# EAGLE design SIPM_readout (EAGLE 9.6.2)
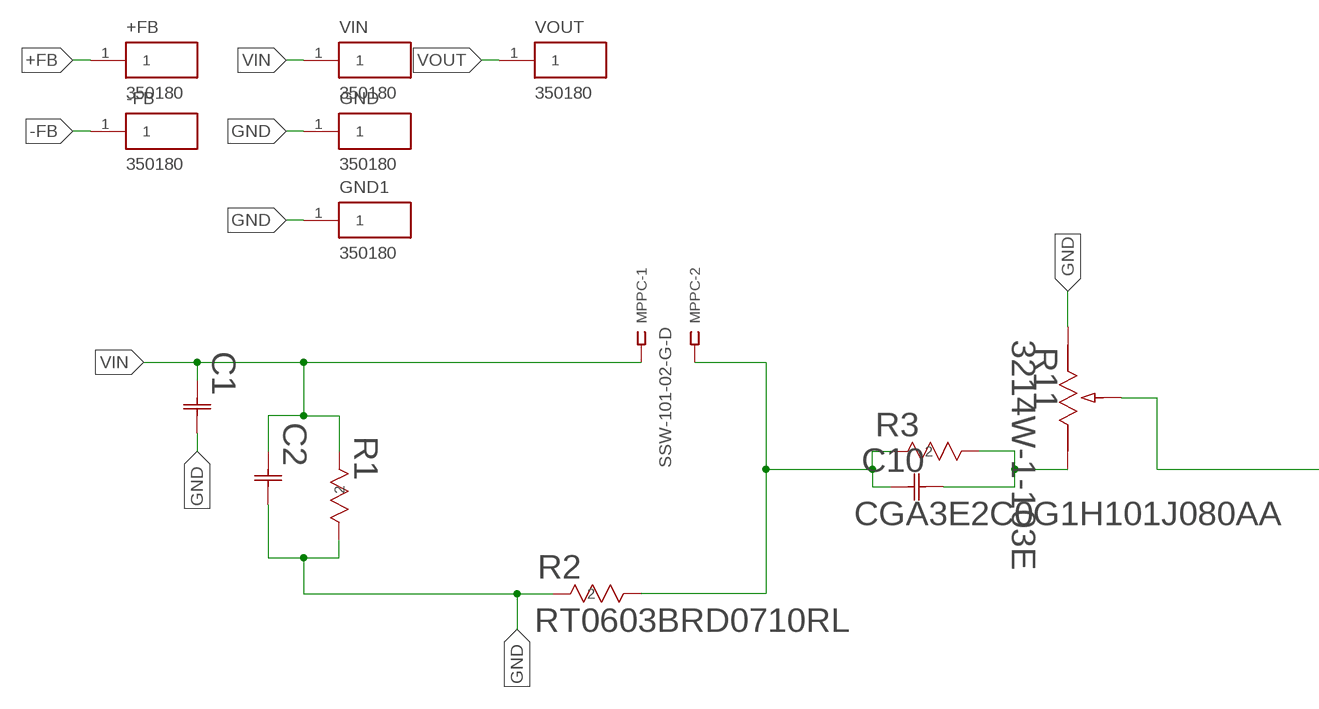
[diagram p0: schematic, sheet 1, part 1 of 2]
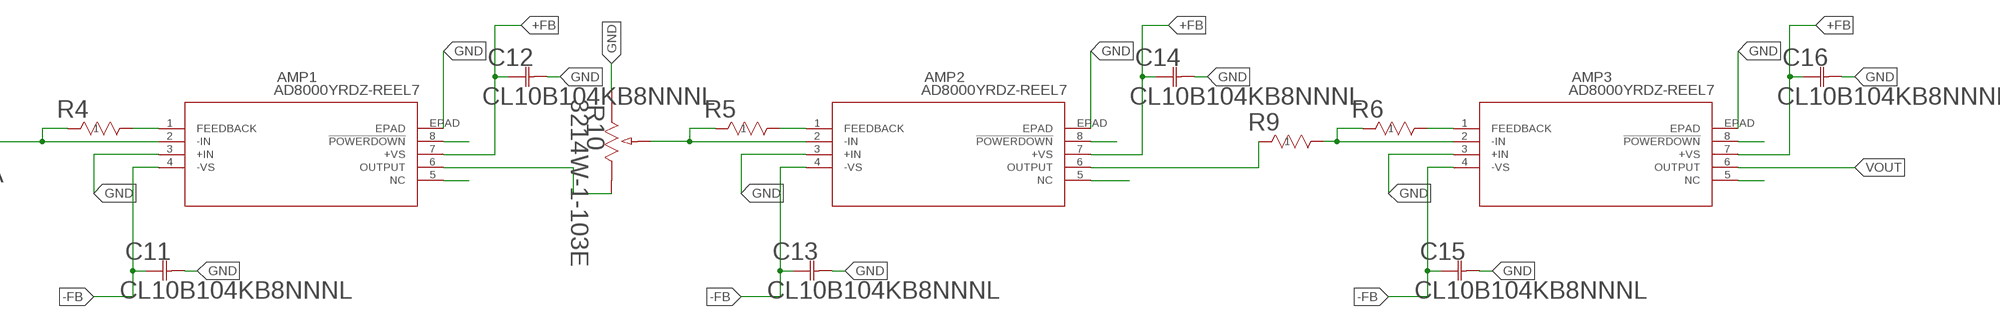
[diagram p1: schematic, sheet 1, part 2 of 2]

## Parts
+FB  350180  [TE_350180]
-FB  350180  [TE_350180]
AMP1  AD8000YRDZ-REEL7  [RD_8_1_ADI]
AMP2  AD8000YRDZ-REEL7  [RD_8_1_ADI]
AMP3  AD8000YRDZ-REEL7  [RD_8_1_ADI]
C1  CGA6P3X7R1H335K250AB  [CAP_3225_TDK]
C2  C3225X7R1H105K160AA  [CAP_3225_TDK]
C10  CGA3E2C0G1H101J080AA  [CAP_1608_TDK]
C11  CL10B104KB8NNNL  [CAP_CL10_SAM]
C12  CL10B104KB8NNNL  [CAP_CL10_SAM]
C13  CL10B104KB8NNNL  [CAP_CL10_SAM]
C14  CL10B104KB8NNNL  [CAP_CL10_SAM]
C15  CL10B104KB8NNNL  [CAP_CL10_SAM]
C16  CL10B104KB8NNNL  [CAP_CL10_SAM]
GND  350180  [TE_350180]
GND1  350180  [TE_350180]
MPPC  SSW-101-02-G-D  [SSW-101-02-G-D]
R1  RC0603FR-072ML  [RC0603N_YAG]
R2  RT0603BRD0710RL  [RC0603N_YAG]
R3  RT0603BRD0710RL  [RC0603N_YAG]
R4  ESR03EZPF1001  [RES_R0603_ROM]
R5  ESR03EZPF1001  [RES_R0603_ROM]
R6  ESR03EZPF1001  [RES_R0603_ROM]
R9  ESR03EZPF1001  [RES_R0603_ROM]
R10  3214W-1-103E  [POT_3214W]
R11  3214W-1-103E  [POT_3214W]
VIN  350180  [TE_350180]
VOUT  350180  [TE_350180]

## Nets
+FB: +FB.1 AMP1.7(+VS) AMP2.7(+VS) AMP3.7(+VS) C12.1 C14.1 C16.1
-FB: -FB.1 AMP1.4(-VS) AMP2.4(-VS) AMP3.4(-VS) C11.1 C13.1 C15.1
GND: AMP1.3(+IN) AMP1.EPAD AMP2.3(+IN) AMP2.EPAD AMP3.3(+IN) AMP3.EPAD C1.2 C2.2 C11.2 C12.2 C13.2 C14.2 C15.2 C16.2 GND1.1 GND.1 R1.1 R2.2 R10.1 R11.1
N$1: AMP1.6(OUTPUT) R10.3
N$2: C10.1 MPPC.2 R2.1 R3.2
N$3: C10.2 R3.1 R11.3
N$4: AMP1.2(-IN) R4.1 R11.2
N$5: AMP1.5(NC)
N$6: AMP1.8(!POWERDOWN)
N$7: AMP1.1(FEEDBACK) R4.2
N$9: AMP2.8(!POWERDOWN)
N$10: AMP2.5(NC)
N$11: AMP2.1(FEEDBACK) R5.2
N$12: AMP2.2(-IN) R5.1 R10.2
N$14: AMP3.8(!POWERDOWN)
N$15: AMP3.5(NC)
N$16: AMP3.1(FEEDBACK) R6.2
N$17: AMP3.2(-IN) R6.1 R9.2
N$18: AMP2.6(OUTPUT) R9.1
VIN: C1.1 C2.1 MPPC.1 R1.2 VIN.1
VOUT: AMP3.6(OUTPUT) VOUT.1

## Library data of the parts
+FB -FB GND GND1 VIN VOUT = SiPM_banana:350180: Connector TeStraight Probe RCP 3 Position Solder Right Angle Thru-Hole 1 Port Check prices <https://pricing.snapeda.com/parts/350180/TE%20Connectivity/view-part?ref=eda>; AVAILABILITY: Good; COMMENT: 350180; DESCRIPTION: Connector TeStraight Probe RCP 3 Position Solder Right Angle Thru-Hole 1 Port; MF: TE Connectivity; MP: 350180; PACKAGE: None; PRICE: None; PURCHASE-URL: https://pricing.snapeda.com/search/part/350180/?ref=eda
AMP1-AMP3 = SiPM_AD8000:AD8000YRDZ-REEL7; BUILT_BY: EMA_Jessica; COPYRIGHT: Copyright (C) 2018 Accelerated Designs. All rights reserved; MANUFACTURER_PART_NUMBER: AD8000YRDZ-REEL7; SOURCELIBRARY: Analog_2019-03-01; VENDOR: Analog Devices Inc
C1 = SiPM_C3:CGA6P3X7R1H335K250AB; BUILT_BY: EMA_UL_Team; MANUFACTURER_PART_NUMBER: CGA6P3X7R1H335K250AB; SOURCELIBRARY: TDK_2015_05_22; VENDOR: TDK
C2 = SiPM_C4:C3225X7R1H105K160AA; BUILT_BY: EMA_UL_Team; MANUFACTURER_PART_NUMBER: C3225X7R1H105K160AA; SOURCELIBRARY: TDK_2015_05_22; VENDOR: TDK
C10 = SiPM_100p:CGA3E2C0G1H101J080AA; BUILT_BY: EMA_UL_Team; MANUFACTURER_PART_NUMBER: CGA3E2C0G1H101J080AA; SOURCELIBRARY: TDK_2015_05_22; VENDOR: TDK
C11-C16 = SiPM_01u:CL10B104KB8NNNL; BUILT_BY: EMA_Rocco; COPYRIGHT: Copyright (C) 2018 Accelerated Designs. All rights reserved; MANUFACTURER_PART_NUMBER: CL10B104KB8NNNL; SOURCELIBRARY: Samsung_2019-08-29; VENDOR: Samsung
MPPC = con-samtec:SSW-101-02-G: THROUGH-HOLE .025" SQ POST SOCKET Source: Samtec SSW.pdf; MF: Samtec Inc.; MPN: SSW-101-02-G-D; OC_FARNELL: unknown; OC_NEWARK: 82P1456
R1 = SiPM_R6:RC0603FR-072ML; BUILT_BY: EMA_UL_Team; MANUFACTURER_PART_NUMBER: RC0603FR-072ML; SOURCELIBRARY: Yageo_2008-01-01_ChipRes1a; VENDOR: Yageo
R2 R3 = SiPM_R7:RT0603BRD0710RL; BUILT_BY: EMA_UL_Team; MANUFACTURER_PART_NUMBER: RT0603BRD0710RL; SOURCELIBRARY: Yageo_2008-01-01_ChipRes2b; VENDOR: Yageo
R4-R6 R9 = SiPM_R11:ESR03EZPF1001; BUILT_BY: EMA_UL_Team; MANUFACTURER_PART_NUMBER: ESR03EZPF1001; SOURCELIBRARY: Rohm_2015_05_27; VENDOR: ROHM Semiconductor
R10 R11 = SiPM_trim:3214W-1-103E; BUILT_BY: EMA_UL_Team; MANUFACTURER_PART_NUMBER: 3214W-1-103E; SOURCELIBRARY: Bourns_2012-08-08; VENDOR: Bourns Electronics

## Board
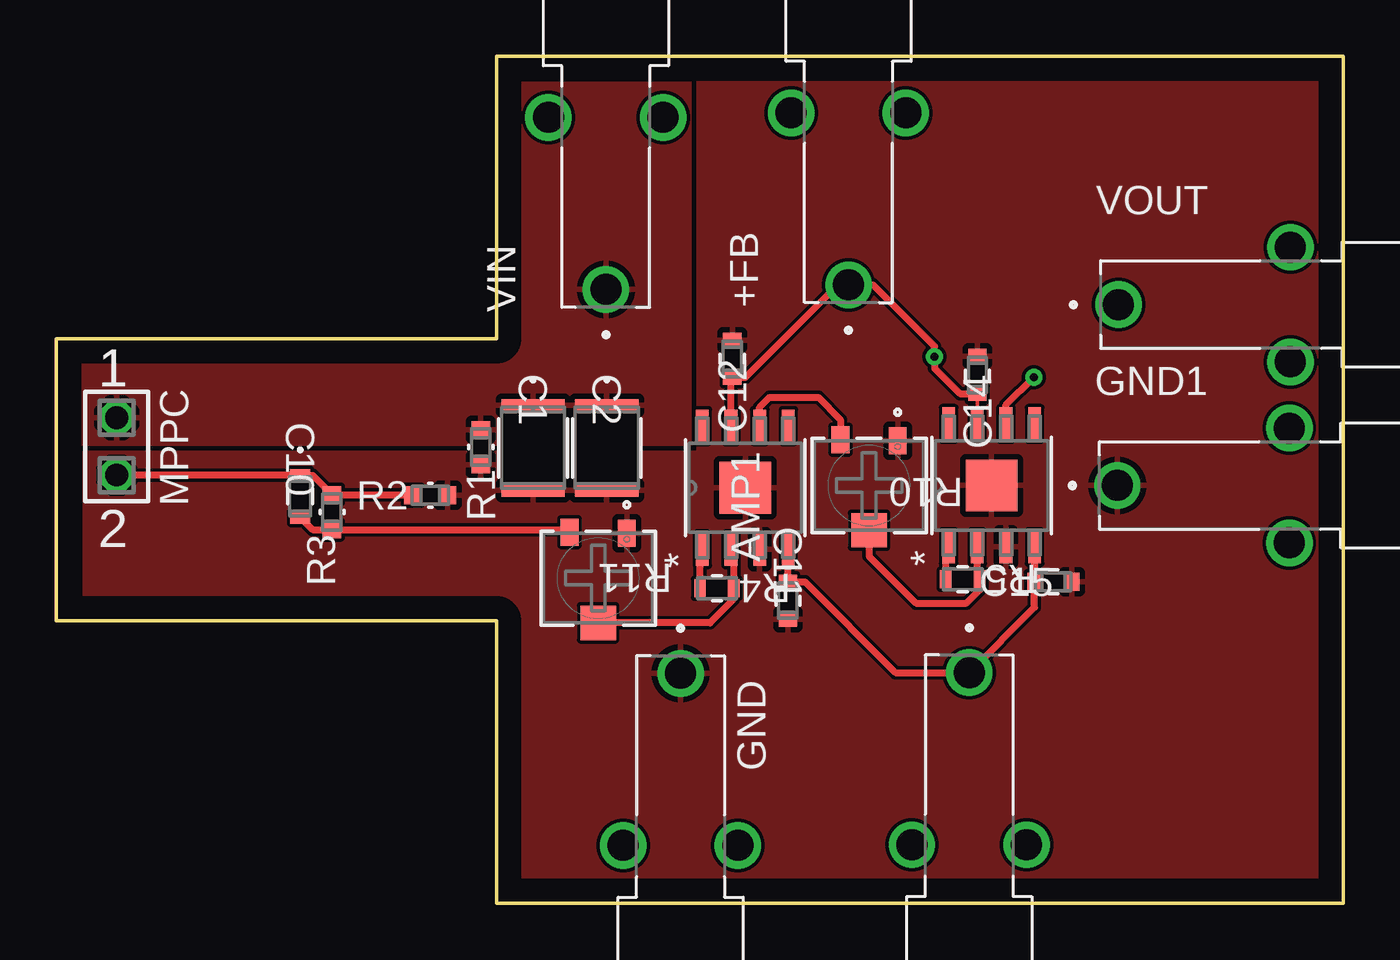
[diagram p2: board, top side]
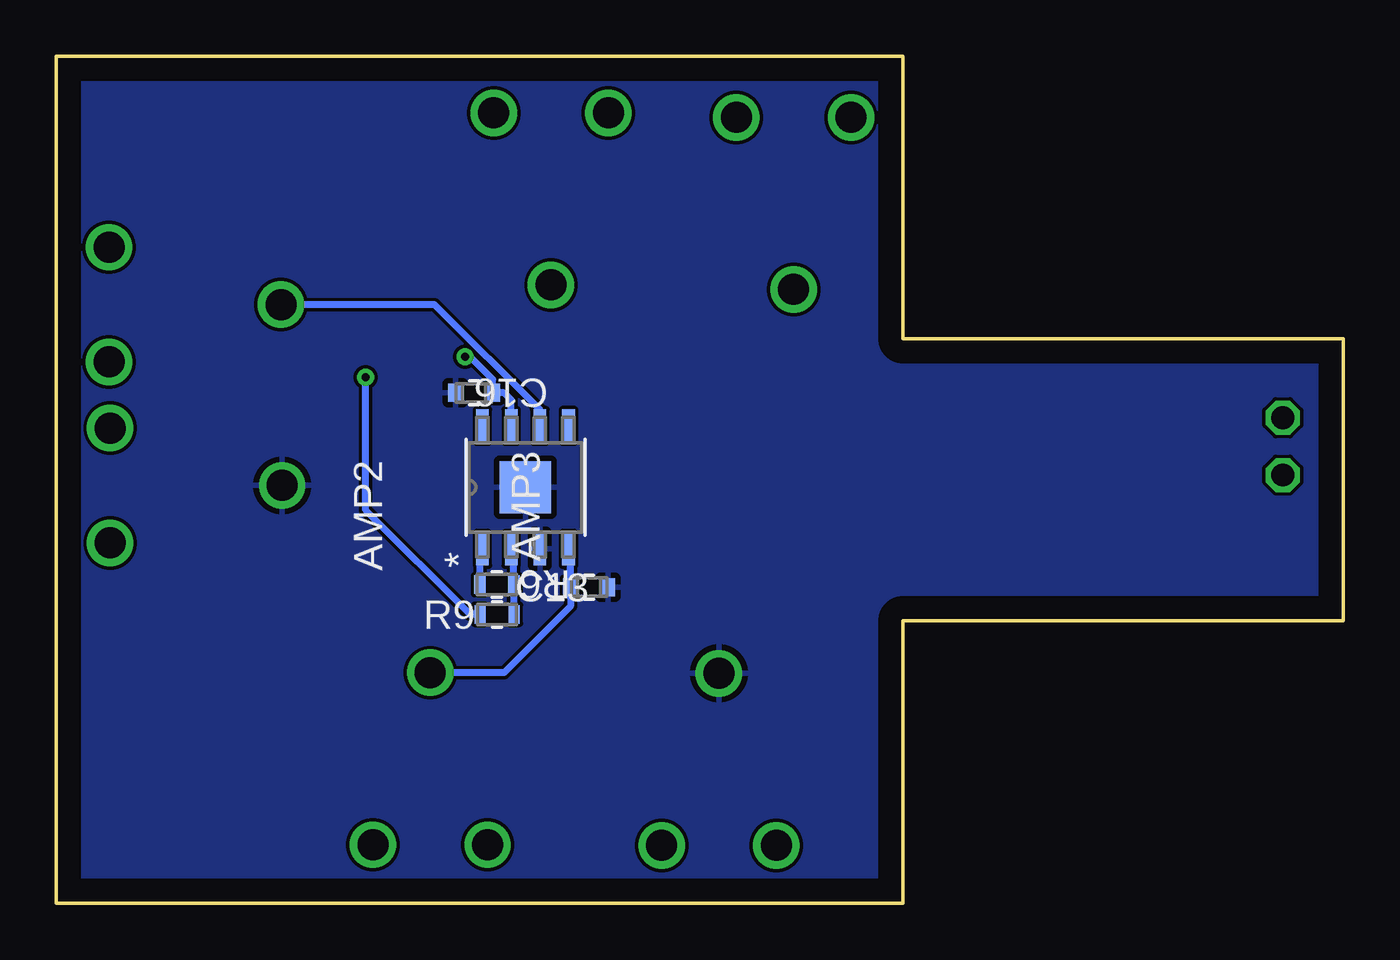
[diagram p3: board, bottom side, seen from below]

Size 57 x 37.5 mm. Coordinates in mm from the lower left corner, seen from the top.
Outline: 57,0 19.5,0 19.5,12.5 0,12.5 0,25 19.5,25 19.5,37.5 57,37.5 57,0
Copper layers (1*16): Top 0.035mm / dielectric 1.5mm / Bottom 0.035mm
Design rules "default": minimum track width 6mil, minimum drill 0.35mm, track to track 6mil, track to pad 6mil, pad to pad 6mil, via to via 6mil, smd to smd 6mil, copper to edge 40mil, drill to drill 6mil, minimum pad ring 10mil, minimum via ring 8mil, stop-mask expansion 4mil, vias tented up to drill 0mil, thermal gap 10mil

### Footprints (pad centres in the part's own frame; a part is rotated, then mirrored left to right if it is on the bottom)
TE_350180 = drill 1.372: 1 0,0; S1 7.62,2.54; S2 7.62,-2.54
RD_8_1_ADI = smd 1.46 x 0.559: 1 -2.724,1.905; 2 -2.724,0.635; 3 -2.724,-0.635; 4 -2.724,-1.905; 5 2.724,-1.905; 6 2.724,-0.635; 7 2.724,0.635; 8 2.724,1.905 | smd 2.286 x 2.286: EPAD 0,0
CAP_3225_TDK = smd 0.559 x 2.794: 1 -1.88,0; 2 1.88,0
CAP_1608_TDK = smd 0.559 x 0.889: 1 -0.927,0; 2 0.927,0
CAP_CL10_SAM = smd 0.656 x 0.8: 1 -0.828,0; 2 0.828,0
SSW-101-02-G-D = drill 1 pad 1.5 octagon: 1 0,-1.27; 2 0,1.27
RC0603N_YAG = smd 0.762 x 0.813: 1 -0.775,0; 2 0.775,0
RES_R0603_ROM = smd 0.5 x 0.813: 1 -0.75,0; 2 0.75,0
POT_3214W = smd 0.787 x 1.194: 1 -1.27,-1.981; 3 1.27,-2.032 | smd 1.575 x 1.524: 2 0,1.981

### Placement (x,y rotation side)
+FB  35.09,27.38 90 top
-FB  40.44,10.21 270 top
AMP1  30.52,18.4 90 top
AMP2  41.43,18.5 90 top
AMP3  36.22,18.42 90 bottom
C1  21.11,20.17 270 top
C2  24.38,20.17 270 top
C10  10.8,18.02 270 top
C11  32.4,13.4 270 top
C12  29.94,24.11 90 top
C13  33.4,14 0 bottom
C14  40.8,23.4 90 top
C15  44.16,14.24 0 top
C16  38.5,22.6 180 bottom
GND  27.65,10.18 270 top
GND1  47,18.5 0 top
MPPC  2.67,20.23 180 top
R1  18.8,20.2 90 top
R2  16.56,18.07 0 top
R3  12.21,17.32 90 top
R4  29.26,13.95 180 top
R5  40.15,14.35 180 top
R6  37.49,14.11 180 bottom
R9  37.48,12.79 0 bottom
R10  36,18.5 180 top
R11  24,14.4 180 top
VIN  24.34,27.18 90 top
VOUT  47.05,26.51 0 top

### Tracks (layer width: path | path; a pad name or v marks a point on that pad's centre or on a via)
+FB  (via drill 0.35)
  Top 0.152: AMP1.7 29.9,21.14 | AMP2.7 C14.1
  Top 0.3: C14.1 40.03,22.57 38.9,23.7 v38.9,24.2 38.9,24.66 36.18,27.38 +FB.1 34.62,27.38 30.52,23.28 C12.1 29.88,23.23 AMP1.7
  Top 0.5: AMP1.7 29.87,21.14
  Bottom 0.3: AMP3.7 36.85,22.3 37.16,22.6 C16.1 37.67,23.2 38.67,24.2 v38.9,24.2
-FB
  Top 0.152: 43.33,13.88 C15.1
  Top 0.3: AMP1.4 32.4,15.65 C11.1 33.15,14.23 37.17,10.21 -FB.1 43.34,13.11 C15.1 | AMP2.4 C15.1 | C15.1
  Bottom 0.152: 34.31,14.09 C13.1
  Bottom 0.3: -FB.1 37.17,10.21 34.23,13.15 C13.1 34.23,15.61 AMP3.4
GND
  Bottom 0.152: 35.92,15.7 AMP3.3
  pour Top: 19.7,0.2 19.7,12.7 1.2,12.7 1.2,20 28.4,20 28.4,37.2 56.8,37.2 56.8,0.1 19.8,0.1
  pour Bottom: 0,12.5 19.5,12.5 19.5,0 57,0 57,37.5 19.5,37.5 19.5,25 0,25
N$1
  Top 0.3: AMP1.6 31.16,21.96 31.59,22.4 33.76,22.4 34.73,21.42 R10.3
N$2
  Top 0.152: 15.75,18.3 15.82,18.22
  Top 0.3: 16.05,18 15.82,18.22 15.82,18.11 R2.1 15.76,18.09 R3.2 11.36,18.95 C10.1 10.79,18.96 MPPC.2
N$3
  Top 0.152: 12.14,16.47 R3.1
  Top 0.3: C10.2 11.35,16.55 R3.1 22.62,16.55 R11.3
  Top 0.5: R3.1 12.17,16.51
N$4
  Top 0.3: R11.2 28.95,12.41 29.97,13.43 29.97,13.91 R4.1 30.01,15.55 AMP1.2
  Top 0.5: R4.1
N$7
  Top 0.3: R4.2 28.51,14.89 28.51,15.57 AMP1.1
N$11
  Top 0.152: AMP2.1 39.4,15.65
  Top 0.3: R5.2 39.4,15.65
N$12
  Top 0.152: 40.89,14.34 R5.1 | 40.9,14.36 40.8,14.47
  Top 0.3: R5.1 40.9,14.36 40.9,13.86 40.32,13.29 38.08,13.29 36,15.37 R10.2 | R5.1 40.8,14.45 40.8,14.47 AMP2.2
N$16
  Bottom 0.3: R6.2 38.24,15.58 AMP3.1
N$17
  Bottom 0.152: 36.81,14.19 R6.1 36.79,14.06
  Bottom 0.3: AMP3.2 36.74,15.58 R6.1 R9.2
N$18  (via drill 0.35)
  Top 0.3: AMP2.6 42.06,22.06 v43.3,23.3
  Bottom 0.3: R9.1 38.68,12.79 43.3,17.41 v43.3,23.3
VIN
  pour Top: 28.1,36.4 19.7,36.4 19.7,24.8 1.1,24.8 1.1,20.3 28.1,20.3
VOUT
  Top 0.5: 46.71,26.51 VOUT.1
  Bottom 0.3: AMP3.6 35.59,21.85 40.25,26.51 VOUT.1